# Altium project LCD_KB_CONTROLLER_hv2.PrjPcb
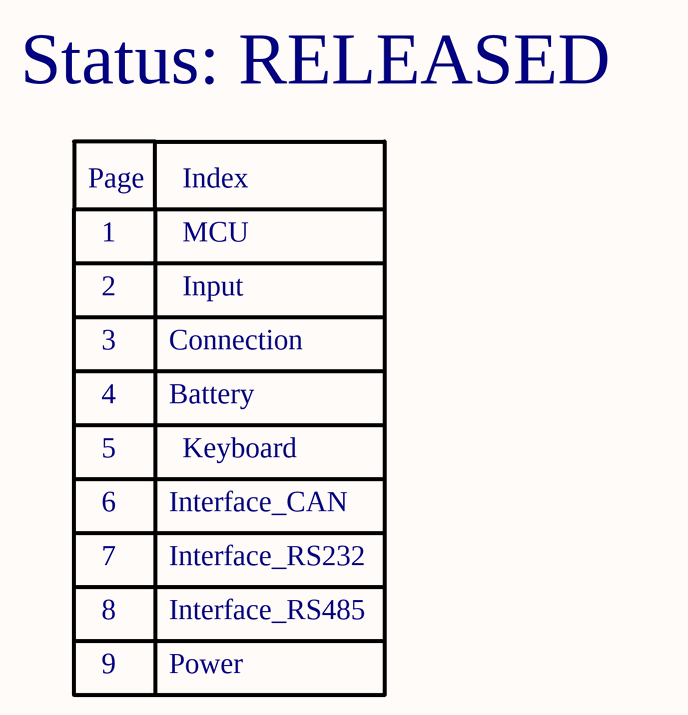
[diagram p0: [0]-Main_Page.SchDoc]
10 sheets, 136 parts. Net scope: flat (ports and power ports of the same name join across sheets).
Board file: LCD_KB_CONTROLLER_hv2.PcbDoc
Sheets:
  [0]-Main_Page.SchDoc
  [1]-MCU.SchDoc
  [2]-Input.SchDoc
  [3]-Connection.SchDoc
  [4]-Battery.SchDoc
  [5]-Keyboard.SchDoc
  [6]-Interface_CAN.SchDoc
  [7]-Interface_RS232.SchDoc
  [8]-Interface_RS485.SchDoc
  [9]-Power.SchDoc

## Sheet [0]-Main_Page.SchDoc
size A4

### Notes on the sheet
- Status: RELEASED
- Page
- Index
- 1
- MCU
- 2
- Input
- 3
- 4
- Connection
- Battery
- 5
- Keyboard
- 6
- Interface_CAN
- 7
- Interface_RS232
- 8
- 9
- Interface_RS485
- Power

## Sheet [1]-MCU.SchDoc
size A4
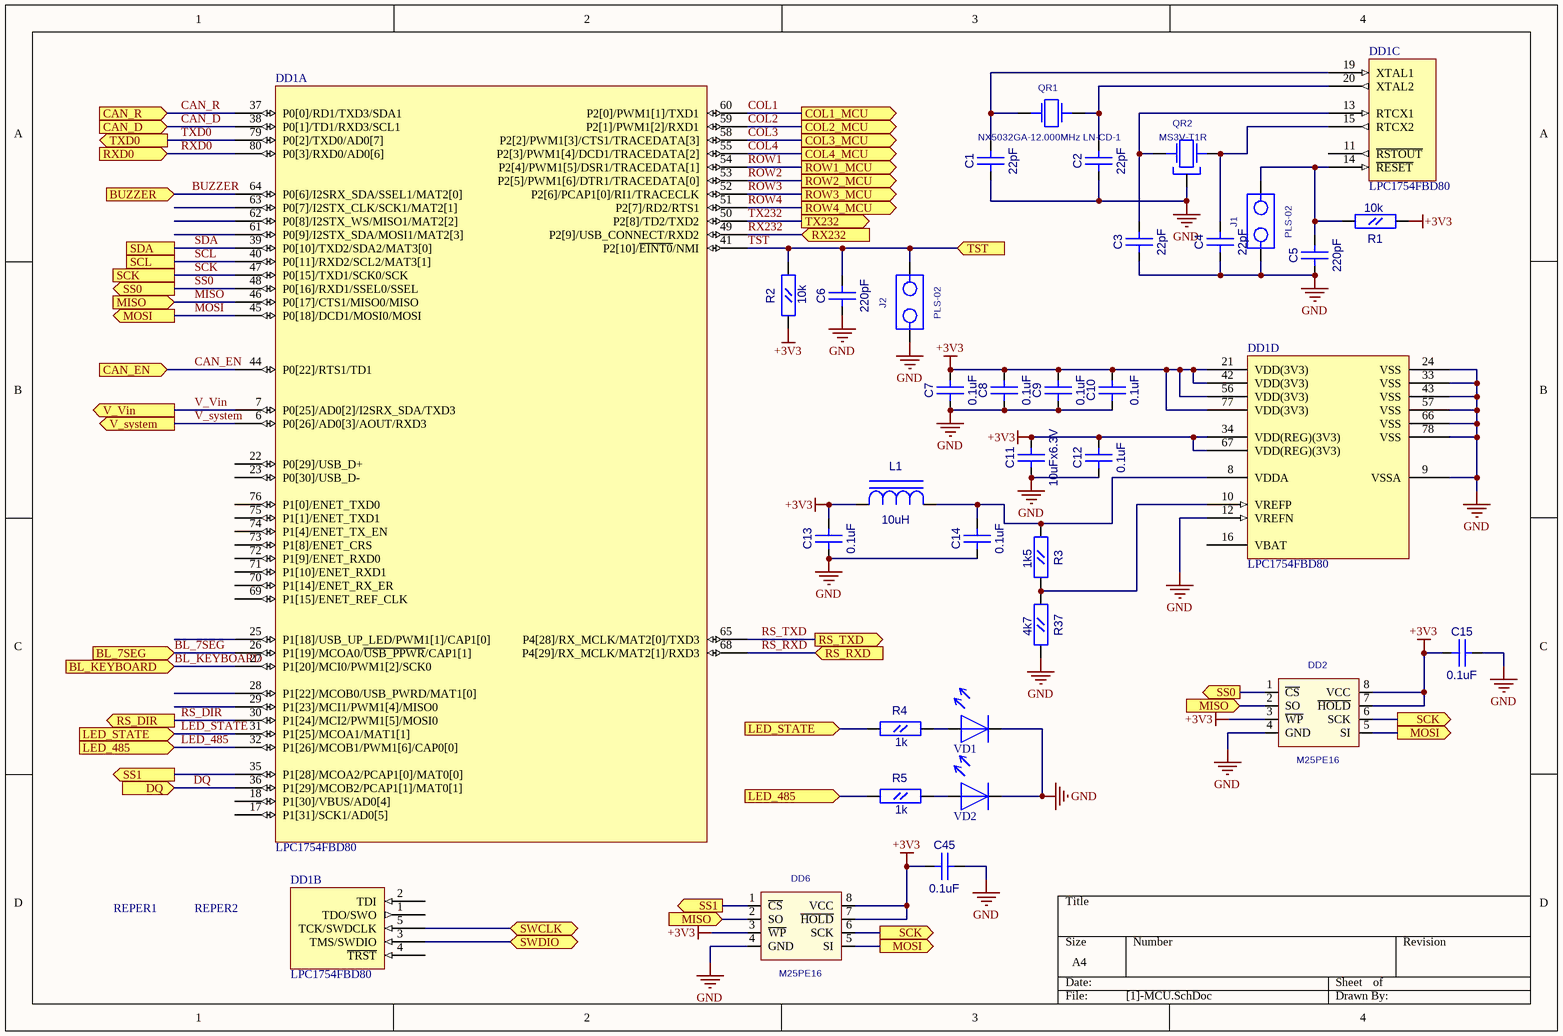
[diagram p1: [1]-MCU.SchDoc]

### Parts
C1  22pF  [CC0603]
C2  22pF  [CC0603]
C3  22pF  [CC0603]
C4  22pF  [CC0603]
C5  220pF  [CC0603]
C6  220pF  [CC0603]
C7  0.1uF  [CC0603]
C8  0.1uF  [CC0603]
C9  0.1uF  [CC0603]
C10  0.1uF  [CC0603]
C11  10uFx6.3V  [CC0805]
C12  0.1uF  [CC0603]
C13  0.1uF  [CC0603]
C14  0.1uF  [CC0603]
C15  0.1uF  [CC0603]
C45  0.1uF  [CC0603]
DD1  LPC1754FBD80  [TQFP-80_0.5]  (parts A,B,C,D of 4)
DD2  M25PE16  [EIAJ_SO8]
DD6  M25PE16  [EIAJ_SO8]
J1  PLS-02  [PLS-02]
J2  PLS-02  [PLS-02]
L1  10uH  [L0603]
QR1  NX5032GA-12.000MHz LN-CD-1  [AC5032_2]
QR2  MS3V-T1R  [MS3V-T1R]
R1  10k  [RC0603]
R2  10k  [RC0603]
R3  1k5  [RC0603]
R4  1k  [RC0603]
R5  1k  [RC0603]
R37  4k7  [RC0603]
REPER1  REPER1.2  [REPER1.2]  (value not drawn)
REPER2  REPER1.2  [REPER1.2]  (value not drawn)
VD1  LED_0805  [LED0805]  (value not drawn)
VD2  LED_0805  [LED0805]  (value not drawn)

### Ports
BL_7SEG (in), BL_KEYBOARD (in), BUZZER (in), CAN_D (in), CAN_EN (in), CAN_R (in), COL1_MCU (out), COL2_MCU (out), COL3_MCU (out), COL4_MCU (out), DQ (in), LED_485 (in), LED_STATE (in), MISO (in), MOSI (out), ROW1_MCU (out), ROW2_MCU (out), ROW3_MCU (out), ROW4_MCU (out), RS_DIR (out), RS_RXD (in), RS_TXD (out), RX232 (in), RXD0 (in), SCK, SCK (out), SCL, SDA, SS0 (out), SS1 (out), SWCLK (bidir), SWDIO (bidir), TST (in), TX232 (out), TXD0 (out), V_system (out), V_Vin (out)

### Nets
+3V3: C7.2(B) C8.2(B) C9.2(B) C10.2(B) C11.2(B) C12.2(B) C13.2(B) C15.1(A) C45.1(A) DD1.21(VDD(3V3)) DD1.34(VDD(REG)(3V3)) DD1.42(VDD(3V3)) DD1.56(VDD(3V3)) DD1.67(VDD(REG)(3V3)) DD1.77(VDD(3V3)) DD2.3(~{WP}) DD2.7(~{HOLD}) DD2.8(VCC) DD6.3(~{WP}) DD6.7(~{HOLD}) DD6.8(VCC) L1.1(A) R1.1(A) R2.1(A)
GND: C1.1(A) C2.1(A) C3.1(A) C4.1(A) C5.1(A) C6.1(A) C7.1(A) C8.1(A) C9.1(A) C10.1(A) C11.1(A) C12.1(A) C13.1(A) C14.1(A) C15.2(B) C45.2(B) DD1.9(VSSA) DD1.12(VREFN) DD1.24(VSS) DD1.33(VSS) DD1.43(VSS) DD1.57(VSS) DD1.66(VSS) DD1.78(VSS) DD2.4(GND) DD6.4(GND) J1.1 J2.1 QR2.3 R37.2(B) VD1.2 VD2.2
BL_7SEG: DD1.26(P1[19]/MCOA0/~{USB_PPWR}/CAP1[1]) ; port BL_7SEG
BL_KEYBOARD: DD1.27(P1[20]/MCI0/PWM1[2]/SCK0) ; port BL_KEYBOARD
BUZZER: DD1.64(P0[6]/I2SRX_SDA/SSEL1/MAT2[0]) ; port BUZZER
CAN_D: DD1.38(P0[1]/TD1/RXD3/SCL1) ; port CAN_D
CAN_EN: DD1.44(P0[22]/RTS1/TD1) ; port CAN_EN
CAN_R: DD1.37(P0[0]/RD1/TXD3/SDA1) ; port CAN_R
COL1: DD1.60(P2[0]/PWM1[1]/TXD1) ; port COL1_MCU
COL2: DD1.59(P2[1]/PWM1[2]/RXD1) ; port COL2_MCU
COL3: DD1.58(P2[2]/PWM1[3]/CTS1/TRACEDATA[3]) ; port COL3_MCU
COL4: DD1.55(P2[3]/PWM1[4]/DCD1/TRACEDATA[2]) ; port COL4_MCU
DQ: DD1.36(P1[29]/MCOB2/PCAP1[1]/MAT0[1]) ; port DQ
LED_485: DD1.32(P1[26]/MCOB1/PWM1[6]/CAP0[0]) R5.1(A) ; port LED_485
LED_STATE: DD1.31(P1[25]/MCOA1/MAT1[1]) R4.1(A) ; port LED_STATE
MISO: DD1.46(P0[17]/CTS1/MISO0/MISO) DD2.2(SO) DD6.2(SO) ; port MISO
MOSI: DD1.45(P0[18]/DCD1/MOSI0/MOSI) DD2.5(SI) DD6.5(SI) ; port MOSI
ROW1: DD1.54(P2[4]/PWM1[5]/DSR1/TRACEDATA[1]) ; port ROW1_MCU
ROW2: DD1.53(P2[5]/PWM1[6]/DTR1/TRACEDATA[0]) ; port ROW2_MCU
ROW3: DD1.52(P2[6]/PCAP1[0]/RI1/TRACECLK) ; port ROW3_MCU
ROW4: DD1.51(P2[7]/RD2/RTS1) ; port ROW4_MCU
RS_DIR: DD1.30(P1[24]/MCI2/PWM1[5]/MOSI0) ; port RS_DIR
RS_RXD: DD1.68(P4[29]/RX_MCLK/MAT2[1]/RXD3) ; port RS_RXD
RS_TXD: DD1.65(P4[28]/RX_MCLK/MAT2[0]/TXD3) ; port RS_TXD
RX232: DD1.49(P2[9]/USB_CONNECT/RXD2) ; port RX232
RXD0: DD1.80(P0[3]/RXD0/AD0[6]) ; port RXD0
SCK: DD1.47(P0[15]/TXD1/SCK0/SCK) DD2.6(SCK) DD6.6(SCK) ; port SCK
SCL: DD1.40(P0[11]/RXD2/SCL2/MAT3[1]) ; port SCL
SDA: DD1.39(P0[10]/TXD2/SDA2/MAT3[0]) ; port SDA
SS0: DD1.48(P0[16]/RXD1/SSEL0/SSEL) DD2.1(~{CS}) ; port SS0
TST: C6.2(B) DD1.41(P2[10]/~{EINT0}/NMI) J2.2 R2.2(B) ; port TST
TX232: DD1.50(P2[8]/TD2/TXD2) ; port TX232
TXD0: DD1.79(P0[2]/TXD0/AD0[7]) ; port TXD0
V_system: DD1.6(P0[26]/AD0[3]/AOUT/RXD3) ; port V_system
V_Vin: DD1.7(P0[25]/AD0[2]/I2SRX_SDA/TXD3) ; port V_Vin
NetC1_2: C1.2(B) DD1.19(XTAL1) QR1.1
NetC2_2: C2.2(B) DD1.20(XTAL2) QR1.2
NetC3_2: C3.2(B) DD1.13(RTCX1) QR2.2(X2)
NetC4_2: C4.2(B) DD1.15(RTCX2) QR2.1(X1)
NetC5_2: C5.2(B) DD1.14(~{RESET}) J1.2 R1.2(B)
NetC14_2: C14.2(B) DD1.8(VDDA) L1.2(C) R3.1(A)
NetDD1_3: DD1.3(TMS/SWDIO) ; port SWDIO
NetDD1_5: DD1.5(TCK/SWDCLK) ; port SWCLK
NetDD1_10: DD1.10(VREFP) R3.2(B) R37.1(A)
NetDD1_35: DD1.35(P1[28]/MCOA2/PCAP1[0]/MAT0[0]) DD6.1(~{CS}) ; port SS1
NetR4_2: R4.2(B) VD1.1
NetR5_2: R5.2(B) VD2.1

Not connected (* = marked no-connect by the designer): DD1 1(TDO/SWO) 2(TDI) 4(~{TRST}) 11(~{RSTOUT}) 16(VBAT) 17(P1[31]/SCK1/AD0[5]) 18(P1[30]/VBUS/AD0[4]) 22(P0[29]/USB_D+) 23(P0[30]/USB_D-) 25(P1[18]/USB_UP_LED/PWM1[1]/CAP1[0]) 28(P1[22]/MCOB0/USB_PWRD/MAT1[0]) 29(P1[23]/MCI1/PWM1[4]/MISO0) 61(P0[9]/I2STX_SDA/MOSI1/MAT2[3]) 62(P0[8]/I2STX_WS/MISO1/MAT2[2]) 63(P0[7]/I2STX_CLK/SCK1/MAT2[1]) 69(P1[15]/ENET_REF_CLK) 70(P1[14]/ENET_RX_ER) 71(P1[10]/ENET_RXD1) 72(P1[9]/ENET_RXD0) 73(P1[8]/ENET_CRS) 74(P1[4]/ENET_TX_EN) 75(P1[1]/ENET_TXD1) 76(P1[0]/ENET_TXD0); REPER1 1; REPER2 1

### Library data of the parts
C1-C10 C12-C15 C45 = CC0603
  C1-C4: Value: 22pF
  C5 C6: Value: 220pF
  C7-C10 C12-C15 C45: Value: 0.1uF
C11 = CC0805: Value: 10uFx6.3V
DD1 = LPC1754FBD80: Cortex -M3 32-Bit Microcontroller, 128KB Flash, 64KB RAM, 800-Lead LQFP; ComponentLink1Description: Manufacturer Link; ComponentLink1URL: http://www.nxp.com/
DD2 DD6 = S25FL016A0LMFI01: Value: M25PE16
L1 = L0603: Value: 10uH
QR1 = AC5032_2: AC5032/2; Value: NX5032GA-12.000MHz LN-CD-1
QR2 = MS3V-T1R: CRYSTAL_32768 Hz; Value: *
R1-R5 R37 = RC0603
  R1 R2: Value: 10k
  R3: Value: 1k5
  R4 R5: Value: 1k
  R37: Value: 4k7
J1 J2 = PLS-02: Value: *
REPER1 REPER2 = REPER1.2: Value: *
VD1 VD2 = LED_0805: Value: LED_0805

## Sheet [2]-Input.SchDoc
size A4
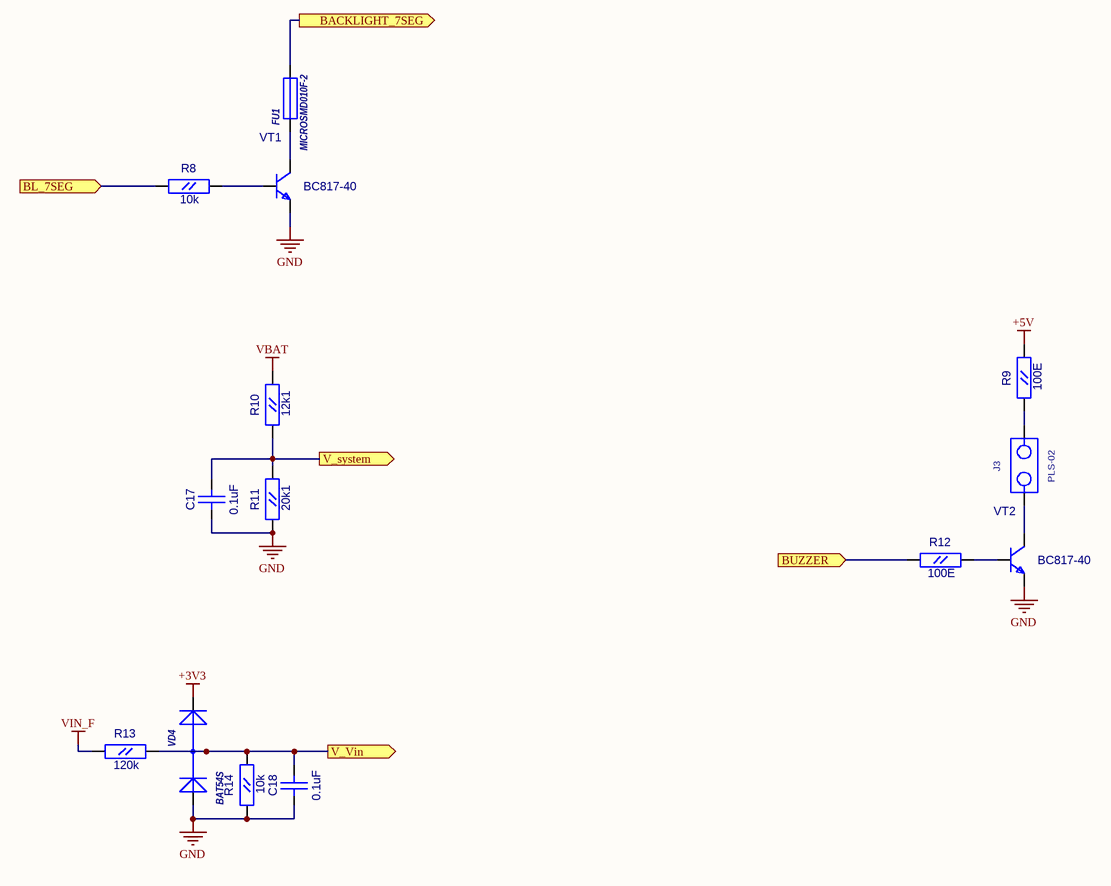
[diagram p2: [2]-Input.SchDoc]

### Parts
C17  0.1uF  [CC0603]
C18  0.1uF  [CC0603]
FU1  MICROSMD010F-2  [RC1210]
J3  PLS-02  [PLS-02]
R8  10k  [RC0603]
R9  100E  [RC0603]
R10  12k1  [RC0603]
R11  20k1  [RC0603]
R12  100E  [RC0603]
R13  120k  [RC0603]
R14  10k  [RC0603]
VD4  BAT54S  [SOT-23(GSD)]
VT1  BC817-40  [SOT-23(123)]
VT2  BC817-40  [SOT-23(123)]

### Ports
BACKLIGHT_7SEG (out), BL_7SEG (in), BUZZER (in), V_system (out), V_Vin (out)

### Nets
+3V3: VD4.2(K)
+5V: R9.2(B)
GND: C17.1(A) C18.1(A) R11.1(A) R14.1(A) VD4.1(A) VT1.2(E) VT2.2(E)
VBAT: R10.2(B)
VIN_F: R13.1(A)
BL: FU1.2 ; port BACKLIGHT_7SEG
BL_7SEG: R8.1(A) ; port BL_7SEG
BUZZER: R12.1(A) ; port BUZZER
V_system: C17.2(B) R10.1(A) R11.2(B) ; port V_system
V_Vin: C18.2(B) R13.2(B) R14.2(B) VD4.3(AK) ; port V_Vin
NetFU1_1: FU1.1 VT1.3(C)
NetJ3_1: J3.1 VT2.3(C)
NetJ3_2: J3.2 R9.1(A)
NetR8_2: R8.2(B) VT1.1(B)
NetR12_2: R12.2(B) VT2.1(B)

### Library data of the parts
C17 C18 = CC0603: Value: 0.1uF
FU1 = MICROSMD: Value: MICROSMD010F-2
R8-R14 = RC0603
  R8 R14: Value: 10k
  R9 R12: Value: 100E
  R10: Value: 12k1
  R11: Value: 20k1
  R13: Value: 120k
VD4 = BAT54S: 1.0 Ampere General Purpose Rectifier; ComponentField6: Published 8-Jun-2000, Modified 11-July-2000: SIM Model Added.; Value: *
VT1 VT2 = BC846BLT1: NPN 500ma transistor; ComponentField7: Published 29-Sep-2000; OriginalName: BC846BLT1; Value: BC817-40
J3 = PLS-02: Value: *

## Sheet [3]-Connection.SchDoc
size A4
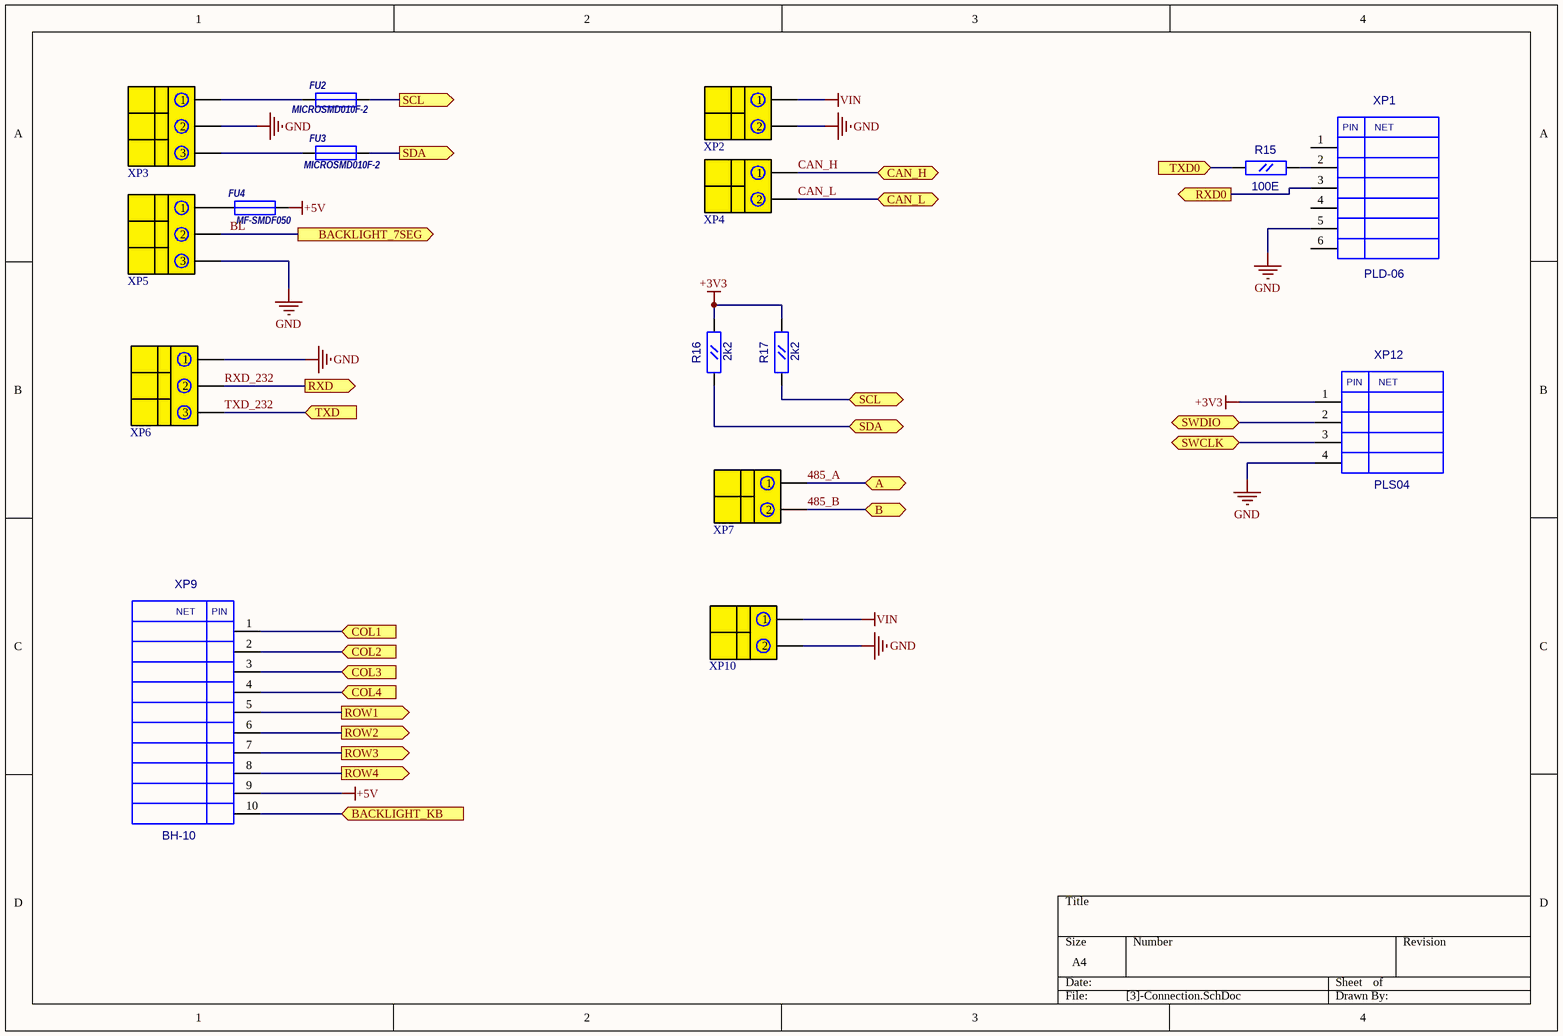
[diagram p3: [3]-Connection.SchDoc]

### Parts
FU2  MICROSMD010F-2  [RC1210]
FU3  MICROSMD010F-2  [RC1210]
FU4  MF-SMDF050  [MF-SMDF]
R15  100E  [RC0603]
R16  2k2  [RC0603]
R17  2k2  [RC0603]
XP1  PLD-06  [PIN6]
XP2  DG330-2PIN  [DG330-2PIN]  (value not drawn)
XP3  DG330-3PIN  [DG330-3PIN]  (value not drawn)
XP4  DG330-2PIN  [DG330-2PIN]  (value not drawn)
XP5  DG330-3PIN  [DG330-3PIN]  (value not drawn)
XP6  DG330-3P  [DG330-3PIN]  (value not drawn)
XP7  DG330-2PIN  [DG330-2PIN]  (value not drawn)
XP9  BH-10  [BH-10]
XP10  DG330-2PIN  [DG330-2PIN]  (value not drawn)
XP12  PLS04  [PIN04S]

### Ports
A (bidir), B (bidir), BACKLIGHT_7SEG (out), BACKLIGHT_KB (in), CAN_H (bidir), CAN_L (bidir), COL1 (in), COL2 (in), COL3 (in), COL4 (in), ROW1 (out), ROW2 (out), ROW3 (out), ROW4 (out), RXD0 (out), RXD (out), SCL (bidir), SCL (out), SDA (bidir), SDA (out), SWCLK (bidir), SWDIO (bidir), TXD0 (in), TXD (in)

### Nets
+3V3: R16.2(B) R17.2(B) XP12.1
+5V: FU4.2 XP9.9
GND: XP1.5 XP2.2 XP3.2 XP5.3 XP6.1 XP10.2 XP12.4
VIN: XP2.1 XP10.1
485_A: XP7.1 ; port A
485_B: XP7.2 ; port B
BL: XP5.2 ; port BACKLIGHT_7SEG
CAN_H: XP4.1 ; port CAN_H
CAN_L: XP4.2 ; port CAN_L
ROW1: XP9.5 ; port ROW1
ROW2: XP9.6 ; port ROW2
ROW3: XP9.7 ; port ROW3
ROW4: XP9.8 ; port ROW4
RXD0: XP1.3 ; port RXD0
RXD_232: XP6.2 ; port RXD  [project net RXD]
SCL: FU2.2 R17.1(A) ; port SCL
SDA: FU3.2 R16.1(A) ; port SDA
TXD0: R15.1(A) ; port TXD0
TXD_232: XP6.3 ; port TXD
NetDD1_3: XP12.2 ; port SWDIO
NetDD1_5: XP12.3 ; port SWCLK
NetFU2_1: FU2.1 XP3.1
NetFU3_1: FU3.1 XP3.3
NetFU4_1: FU4.1 XP5.1
NetFU5_2: XP9.10 ; port BACKLIGHT_KB
NetR15_2: R15.2(B) XP1.2
NetVD5_1: XP9.3 ; port COL3
NetVD6_1: XP9.1 ; port COL1
NetVD7_1: XP9.4 ; port COL4
NetVD8_1: XP9.2 ; port COL2

Not connected (* = marked no-connect by the designer): XP1 1 4 6

### Notes on the sheet
- (in symbol BH-10) NET; PIN
- (in symbol PLD-06) PIN; NET
- (in symbol PLS04) PIN; NET

### Library data of the parts
FU2 FU3 = MICROSMD: Value: MICROSMD010F-2
FU4 = MF-SMDF: Value: MF-SMDF050
R15-R17 = RC0603
  R15: Value: 100E
  R16 R17: Value: 2k2
XP1 = PLD-06: PLD06; Value: *
XP6 = DG330-3PIN: Value: DG330-3P
XP2 XP4 XP7 XP10 = DG330-2PIN: Value: DG330-2PIN
XP3 XP5 = DG330-3PIN: Value: DG330-3PIN
XP9 = BH-10: Value: *
XP12 = PLS04: Value: *

## Sheet [4]-Battery.SchDoc
size A4
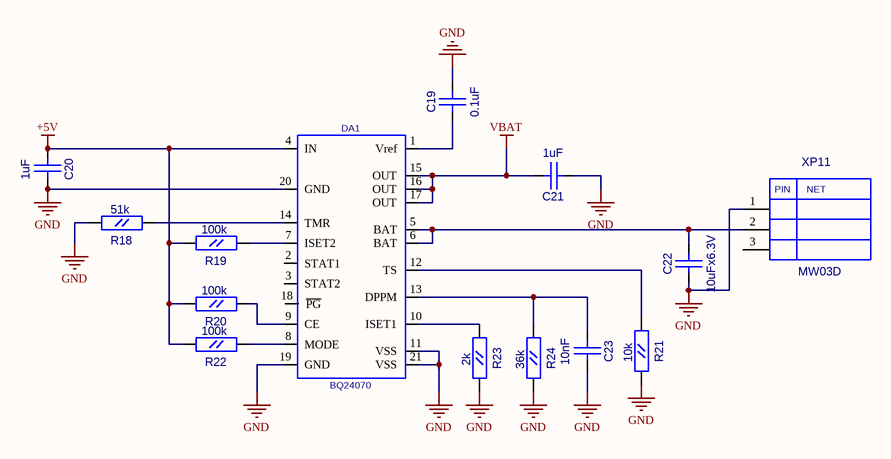
[diagram p4: [4]-Battery.SchDoc]

### Parts
C19  0.1uF  [CC0603]
C20  1uF  [CC0603]
C21  1uF  [CC0603]
C22  10uFx6.3V  [CC0805]
C23  10nF  [CC0603]
DA1  BQ24070  [P-PQFP-N20]
R18  51k  [RC0603]
R19  100k  [RC0603]
R20  100k  [RC0603]
R21  10k  [RC0603]
R22  100k  [RC0603]
R23  2k  [RC0603]
R24  36k  [RC0603]
XP11  MW03D  [MW03D]

### Nets
+5V: C20.1(A) DA1.4(IN) R19.2(B) R20.2(B) R22.2(B)
GND: C19.2(B) C20.2(B) C21.1(A) C22.1(A) C23.2(B) DA1.11(VSS) DA1.19(GND) DA1.20(GND) DA1.21(VSS) R18.2(B) R21.2(B) R23.2(B) R24.2(B) XP11.1
VBAT: C21.2(B) DA1.15(OUT) DA1.16(OUT) DA1.17(OUT)
NetC19_1: C19.1(A) DA1.1(Vref)
NetC22_2: C22.2(B) DA1.5(BAT) DA1.6(BAT) XP11.2
NetC23_1: C23.1(A) DA1.13(DPPM) R24.1(A)
NetDA1_7: DA1.7(ISET2) R19.1(A)
NetDA1_8: DA1.8(MODE) R22.1(A)
NetDA1_9: DA1.9(CE) R20.1(A)
NetDA1_10: DA1.10(ISET1) R23.1(A)
NetDA1_12: DA1.12(TS) R21.1(A)
NetDA1_14: DA1.14(TMR) R18.1(A)

Not connected (* = marked no-connect by the designer): DA1 2(STAT1) 3(STAT2) 18(~{PG}); XP11 3

### Notes on the sheet
- (in symbol MW03D) PIN; NET

### Library data of the parts
C19-C21 C23 = CC0603
  C19: Value: 0.1uF
  C20 C21: Value: 1uF
  C23: Value: 10nF
C22 = CC0805: Value: 10uFx6.3V
R18-R24 = RC0603
  R18: Value: 51k
  R19 R20 R22: Value: 100k
  R21: Value: 10k
  R23: Value: 2k
  R24: Value: 36k
DA1 = BQ24070: Value: *
XP11 = MW03D: Value: *

## Sheet [5]-Keyboard.SchDoc
size A4
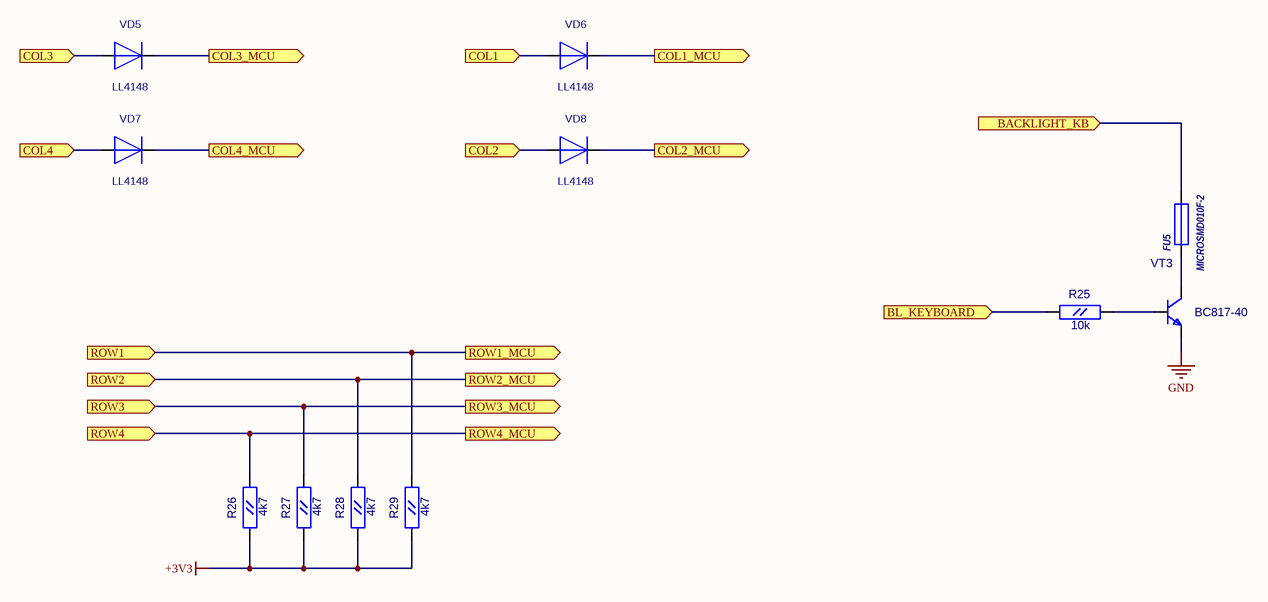
[diagram p5: [5]-Keyboard.SchDoc]

### Parts
FU5  MICROSMD010F-2  [RC1210]
R25  10k  [RC0603]
R26  4k7  [RC0603]
R27  4k7  [RC0603]
R28  4k7  [RC0603]
R29  4k7  [RC0603]
VD5  LL4148  [SOD-80]
VD6  LL4148  [SOD-80]
VD7  LL4148  [SOD-80]
VD8  LL4148  [SOD-80]
VT3  BC817-40  [SOT-23(123)]

### Ports
BACKLIGHT_KB (in), BL_KEYBOARD (in), COL1 (in), COL1_MCU (out), COL2 (in), COL2_MCU (out), COL3 (in), COL3_MCU (out), COL4 (in), COL4_MCU (out), ROW1 (in), ROW1_MCU (out), ROW2 (in), ROW2_MCU (out), ROW3 (in), ROW3_MCU (out), ROW4 (in), ROW4_MCU (out)

### Nets
+3V3: R26.1(A) R27.1(A) R28.1(A) R29.1(A)
GND: VT3.2(E)
BL_KEYBOARD: R25.1(A) ; port BL_KEYBOARD
COL1: VD6.2(+) ; port COL1_MCU
COL2: VD8.2(+) ; port COL2_MCU
COL3: VD5.2(+) ; port COL3_MCU
COL4: VD7.2(+) ; port COL4_MCU
ROW1: R29.2(B) ; port ROW1_MCU, port ROW1
ROW2: R28.2(B) ; port ROW2_MCU, port ROW2
ROW3: R27.2(B) ; port ROW3_MCU, port ROW3
ROW4: R26.2(B) ; port ROW4_MCU, port ROW4
NetFU5_1: FU5.1 VT3.3(C)
NetFU5_2: FU5.2 ; port BACKLIGHT_KB
NetR25_2: R25.2(B) VT3.1(B)
NetVD5_1: VD5.1(-) ; port COL3
NetVD6_1: VD6.1(-) ; port COL1
NetVD7_1: VD7.1(-) ; port COL4
NetVD8_1: VD8.1(-) ; port COL2

### Library data of the parts
FU5 = MICROSMD: Value: MICROSMD010F-2
R25-R29 = RC0603
  R25: Value: 10k
  R26-R29: Value: 4k7
VT3 = BC846BLT1: as VT1 on sheet [2]-Input; OriginalName: BC846BLT1; Value: BC817-40
VD5-VD8 = LL4148: Value: *

## Sheet [6]-Interface_CAN.SchDoc
size A4
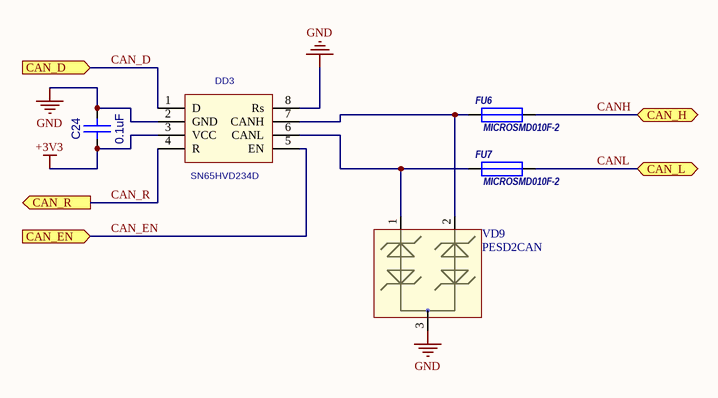
[diagram p6: [6]-Interface_CAN.SchDoc]

### Parts
C24  0.1uF  [CC0603]
DD3  SN65HVD234D  [SO-8]
FU6  MICROSMD010F-2  [RC1210]
FU7  MICROSMD010F-2  [RC1210]
VD9  PESD2CAN  [SOT-23(123)]

### Ports
CAN_D (in), CAN_EN (in), CAN_H (bidir), CAN_L (bidir), CAN_R (out)

### Nets
+3V3: C24.1(A) DD3.3(VCC)
GND: C24.2(B) DD3.2(GND) DD3.8(Rs) VD9.3
CAN_D: DD3.1(D) ; port CAN_D
CAN_EN: DD3.5(EN) ; port CAN_EN
CAN_R: DD3.4(R) ; port CAN_R
CANH: FU6.2 ; port CAN_H  [project net CAN_H]
CANL: FU7.2 ; port CAN_L  [project net CAN_L]
NetDD3_6: DD3.6(CANL) FU7.1 VD9.1
NetDD3_7: DD3.7(CANH) FU6.1 VD9.2

### Library data of the parts
C24 = CC0603: Value: 0.1uF
DD3 = SN65HVD234D: CAN Transceiver; Value: *
FU6 FU7 = MICROSMD: Value: MICROSMD010F-2
VD9 = PESD2CAN: TVS for CAN

## Sheet [7]-Interface_RS232.SchDoc
size A4
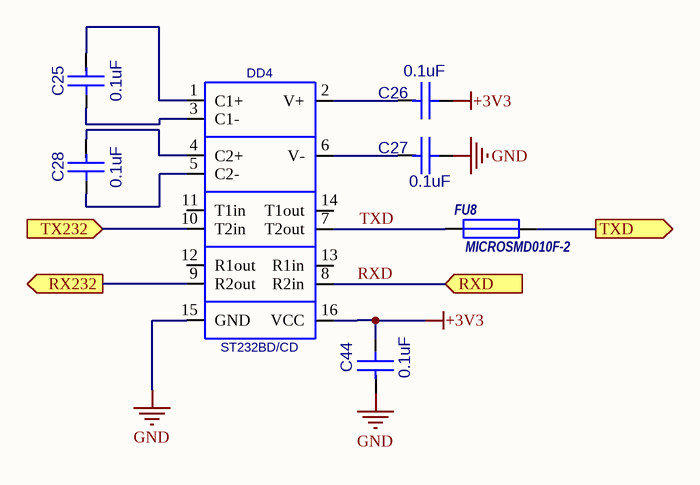
[diagram p7: [7]-Interface_RS232.SchDoc]

### Parts
C25  0.1uF  [CC0603]
C26  0.1uF  [CC0603]
C27  0.1uF  [CC0603]
C28  0.1uF  [CC0603]
C44  0.1uF  [CC0603]
DD4  ST232BD/CD  [SO16_M]
FU8  MICROSMD010F-2  [RC1210]

### Ports
RX232 (out), RXD (in), TX232 (in), TXD (out)

### Nets
+3V3: C26.1(A) C44.1(A) DD4.16(VCC)
GND: C27.1(A) C44.2(B) DD4.15(GND)
RX232: DD4.9(R2out) ; port RX232
RXD: DD4.8(R2in) ; port RXD
TX232: DD4.10(T2in) ; port TX232
TXD: DD4.7(T2out) FU8.1
TXD_232: FU8.2 ; port TXD
NetC25_1: C25.1(A) DD4.3(C1-)
NetC25_2: C25.2(B) DD4.1(C1+)
NetC26_2: C26.2(B) DD4.2(V+)
NetC27_2: C27.2(B) DD4.6(V-)
NetC28_1: C28.1(A) DD4.5(C2-)
NetC28_2: C28.2(B) DD4.4(C2+)

Not connected (* = marked no-connect by the designer): DD4 11(T1in) 12(R1out) 13(R1in) 14(T1out)

### Library data of the parts
C25-C28 C44 = CC0603: Value: 0.1uF
FU8 = MICROSMD: Value: MICROSMD010F-2
DD4 = ST232BD/CD: Value: *

## Sheet [8]-Interface_RS485.SchDoc
size A4
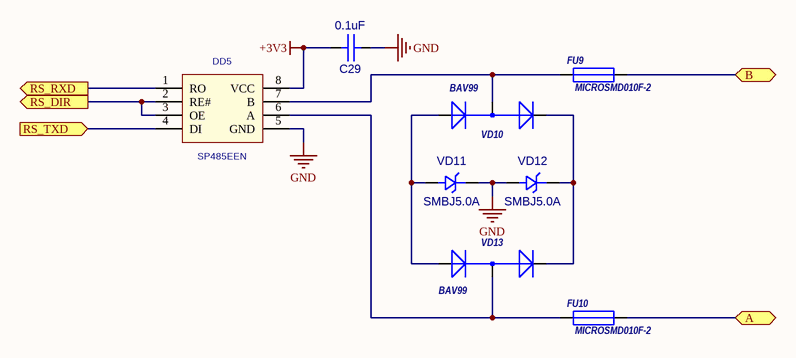
[diagram p8: [8]-Interface_RS485.SchDoc]

### Parts
C29  0.1uF  [CC0603]
DD5  SP485EEN  [SO-8]
FU9  MICROSMD010F-2  [RC1210]
FU10  MICROSMD010F-2  [RC1210]
VD10  BAV99  [SOT-23(GSD)]
VD11  SMBJ5.0A  [SMB]
VD12  SMBJ5.0A  [SMB]
VD13  BAV99  [SOT-23(GSD)]

### Ports
A (bidir), B (bidir), RS_DIR (out), RS_RXD (out), RS_TXD (in)

### Nets
+3V3: C29.2(B) DD5.8(VCC)
GND: C29.1(A) DD5.5(GND) VD11.2(K) VD12.1(A)
485_A: FU10.2 ; port A
485_B: FU9.2 ; port B
RS_DIR: DD5.2(RE#) DD5.3(OE) ; port RS_DIR
RS_RXD: DD5.1(RO) ; port RS_RXD
RS_TXD: DD5.4(DI) ; port RS_TXD
NetDD5_6: DD5.6(A) FU10.1 VD13.3(AK)
NetDD5_7: DD5.7(B) FU9.1 VD10.3(AK)
NetVD10_1: VD10.1(A) VD11.1(A) VD13.1(A)
NetVD10_2: VD10.2(K) VD12.2(K) VD13.2(K)

### Library data of the parts
C29 = CC0603: Value: 0.1uF
DD5 = SP485: Value: *
FU9 FU10 = MICROSMD: Value: MICROSMD010F-2
VD10 VD13 = BAV99: 1.0 Ampere General Purpose Rectifier; ComponentField6: Published 8-Jun-2000, Modified 11-July-2000: SIM Model Added.; Value: *
VD11 VD12 = SMBJ: Value: SMBJ5.0A

## Sheet [9]-Power.SchDoc
size A4
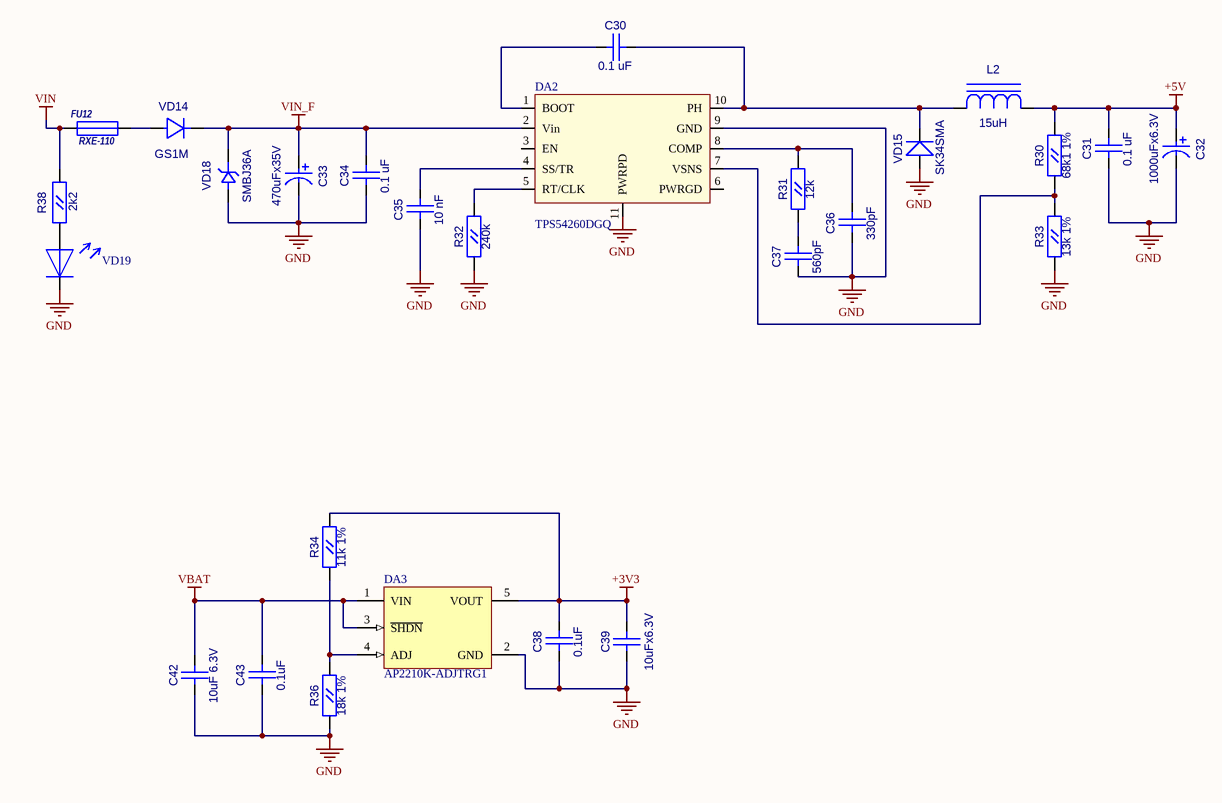
[diagram p9: [9]-Power.SchDoc]

### Parts
C30  0.1 uF  [CC0603]
C31  0.1 uF  [CC0603]
C32  1000uFx6.3V  [CC8X3.5]
C33  470uFx35V  [CC16X10_CAP0.5(1)(Primary)]
C34  0.1 uF  [CC0603]
C35  10 nF  [CC0603]
C36  330pF  [CC0603]
C37  560pF  [CC0603]
C38  0.1uF  [CC0603]
C39  10uFx6.3V  [CC0805]
C42  10uF 6.3V  [CC0805]
C43  0.1uF  [CC0603]
DA2  TPS54260DGQ  [S-PDSO-G10]
DA3  AP2210K-ADJTRG1  [SOT23-5]
FU12  RXE-110  [RXE-110]
L2  15uH  [SDR0805]
R30  68k1 1%  [RC0603]
R31  12k  [RC0603]
R32  240k  [RC0603]
R33  13k 1%  [RC0603]
R34  11k 1%  [RC0603]
R36  18k 1%  [RC0603]
R38  2k2  [RC0603]
VD14  GS1M  [SMA]
VD15  SK34SMA  [SMA]
VD18  SMBJ36A  [SMB]
VD19  LED_0805  [LED0805]  (value not drawn)

### Nets
+3V3: C38.1(A) C39.2(B) DA3.5(VOUT) R34.2(B)
+5V: C31.1(A) C32.1 L2.2(A) R30.2(B)
GND: C31.2(B) C32.2 C33.1 C34.2(B) C35.2(B) C36.2(B) C37.2(B) C38.2(B) C39.1(A) C42.1(A) C43.2(B) DA2.9(GND) DA2.11(PWRPD) DA3.2(GND) R32.1(A) R33.1(A) R36.1(A) VD15.1(A) VD18.1(A) VD19.2
VBAT: C42.2(B) C43.1(A) DA3.1(VIN) DA3.3(~{SHDN})
VIN: FU12.1 R38.2(B)
VIN_F: C33.2 C34.1(A) DA2.2(Vin) VD14.2(K) VD18.2(K)
NetC30_1: C30.1(A) DA2.10(PH) L2.1(C) VD15.2(K)
NetC30_2: C30.2(B) DA2.1(BOOT)
NetC35_1: C35.1(A) DA2.4(SS/TR)
NetC36_1: C36.1(A) DA2.8(COMP) R31.2(B)
NetC37_1: C37.1(A) R31.1(A)
NetDA2_5: DA2.5(RT/CLK) R32.2(B)
NetDA2_7: DA2.7(VSNS) R30.1(A) R33.2(B)
NetDA3_4: DA3.4(ADJ) R34.1(A) R36.2(B)
NetFU12_2: FU12.2 VD14.1(A)
NetR38_1: R38.1(A) VD19.1

Not connected (* = marked no-connect by the designer): DA2 3(EN) 6(PWRGD)

### Library data of the parts
C30 C31 C34-C38 C43 = CC0603
  C30 C31 C34: Value: 0.1 uF
  C35: Value: 10 nF
  C36: Value: 330pF
  C37: Value: 560pF
  C38 C43: Value: 0.1uF
C32 = CAP0.35: Value: 1000uFx6.3V
C33 = CAP0.5(1): Value: 470uFx35V
C39 C42 = CC0805
  C39: Value: 10uFx6.3V
  C42: Value: 10uF 6.3V
DA3 = MCP1824T-ADJE/OT: 300 mA, Low Voltage, Low Quiescent Current LDO Regulator, 5-Pin SOT-223, Extended Temperature, Tape and Reel; Published: 29-Jan-2009; DatasheetVersion: revA, Aug-2007; PackageVersion: revAW, Oct-2008; PackageReference: SOT-223-DC5; Publisher: Altium Limited; PackageDescription: 5-Lead Plastic Small Outline Transistor (DC) [SOT-223]; ComponentLink1Description: Manufacturer Link; ComponentLink1URL: http://www.microchip.com; ComponentLink2Description: Datasheet; ComponentLink2URL: http://ww1.microchip.com/downloads/en/DeviceDoc/22070a.pdf; ComponentLink3Description: Packaging Specification; ComponentLink3URL: http://ww1.microchip.com/downloads/en/PackagingSpec/00049AW.pdf
L2 = SDR0805: Value: 15uH
R30-R34 R36 R38 = RC0603
  R30: Value: 68k1 1%
  R31: Value: 12k
  R32: Value: 240k
  R33: Value: 13k 1%
  R34: Value: 11k 1%
  R36: Value: 18k 1%
  R38: Value: 2k2
VD14 = GS1M: Value: {Value}
VD15 = SK34SMA: Schottky Rectifier; Value: {Value}
VD18 = SMBJ: Value: SMBJ36A
FU12 = RXE-110: Value: *
VD19 = LED_0805: Value: LED_0805

## Nets that join several sheets
+3V3: [1]-MCU (24 pins), [2]-Input (VD4.2), [3]-Connection (R16.2 R17.2 XP12.1), [5]-Keyboard (R26.1 R27.1 R28.1 R29.1), [6]-Interface_CAN (C24.1 DD3.3), [7]-Interface_RS232 (C26.1 C44.1 DD4.16), [8]-Interface_RS485 (C29.2 DD5.8), [9]-Power (C38.1 C39.2 DA3.5 R34.2)
+5V: [2]-Input (R9.2), [3]-Connection (FU4.2 XP9.9), [4]-Battery (5 pins), [9]-Power (C31.1 C32.1 L2.2 R30.2)
GND: [1]-MCU (32 pins), [2]-Input (7 pins), [3]-Connection (7 pins), [4]-Battery (14 pins), [5]-Keyboard (VT3.2), [6]-Interface_CAN (C24.2 DD3.2 DD3.8 VD9.3), [7]-Interface_RS232 (C27.1 C44.2 DD4.15), [8]-Interface_RS485 (C29.1 DD5.5 VD11.2 VD12.1), [9]-Power (20 pins)
VBAT: [2]-Input (R10.2), [4]-Battery (C21.2 DA1.15 DA1.16 DA1.17), [9]-Power (C42.2 C43.1 DA3.1 DA3.3)
VIN: [3]-Connection (XP2.1 XP10.1), [9]-Power (FU12.1 R38.2)
VIN_F: [2]-Input (R13.1), [9]-Power (5 pins)
485_A: [3]-Connection (XP7.1), [8]-Interface_RS485 (FU10.2)
485_B: [3]-Connection (XP7.2), [8]-Interface_RS485 (FU9.2)
BL: [2]-Input (FU1.2), [3]-Connection (XP5.2)
BL_7SEG: [1]-MCU (DD1.26), [2]-Input (R8.1)
BL_KEYBOARD: [1]-MCU (DD1.27), [5]-Keyboard (R25.1)
BUZZER: [1]-MCU (DD1.64), [2]-Input (R12.1)
CAN_D: [1]-MCU (DD1.38), [6]-Interface_CAN (DD3.1)
CAN_EN: [1]-MCU (DD1.44), [6]-Interface_CAN (DD3.5)
CAN_H: [3]-Connection (XP4.1), [6]-Interface_CAN (FU6.2)
CAN_L: [3]-Connection (XP4.2), [6]-Interface_CAN (FU7.2)
CAN_R: [1]-MCU (DD1.37), [6]-Interface_CAN (DD3.4)
COL1: [1]-MCU (DD1.60), [5]-Keyboard (VD6.2)
COL2: [1]-MCU (DD1.59), [5]-Keyboard (VD8.2)
COL3: [1]-MCU (DD1.58), [5]-Keyboard (VD5.2)
COL4: [1]-MCU (DD1.55), [5]-Keyboard (VD7.2)
NetDD1_3: [1]-MCU (DD1.3), [3]-Connection (XP12.2)
NetDD1_5: [1]-MCU (DD1.5), [3]-Connection (XP12.3)
NetFU5_2: [3]-Connection (XP9.10), [5]-Keyboard (FU5.2)
NetVD5_1: [3]-Connection (XP9.3), [5]-Keyboard (VD5.1)
NetVD6_1: [3]-Connection (XP9.1), [5]-Keyboard (VD6.1)
NetVD7_1: [3]-Connection (XP9.4), [5]-Keyboard (VD7.1)
NetVD8_1: [3]-Connection (XP9.2), [5]-Keyboard (VD8.1)
ROW1: [1]-MCU (DD1.54), [3]-Connection (XP9.5), [5]-Keyboard (R29.2)
ROW2: [1]-MCU (DD1.53), [3]-Connection (XP9.6), [5]-Keyboard (R28.2)
ROW3: [1]-MCU (DD1.52), [3]-Connection (XP9.7), [5]-Keyboard (R27.2)
ROW4: [1]-MCU (DD1.51), [3]-Connection (XP9.8), [5]-Keyboard (R26.2)
RS_DIR: [1]-MCU (DD1.30), [8]-Interface_RS485 (DD5.2 DD5.3)
RS_RXD: [1]-MCU (DD1.68), [8]-Interface_RS485 (DD5.1)
RS_TXD: [1]-MCU (DD1.65), [8]-Interface_RS485 (DD5.4)
RX232: [1]-MCU (DD1.49), [7]-Interface_RS232 (DD4.9)
RXD: [3]-Connection (XP6.2), [7]-Interface_RS232 (DD4.8)
RXD0: [1]-MCU (DD1.80), [3]-Connection (XP1.3)
SCL: [1]-MCU (DD1.40), [3]-Connection (FU2.2 R17.1)
SDA: [1]-MCU (DD1.39), [3]-Connection (FU3.2 R16.1)
TX232: [1]-MCU (DD1.50), [7]-Interface_RS232 (DD4.10)
TXD0: [1]-MCU (DD1.79), [3]-Connection (R15.1)
TXD_232: [3]-Connection (XP6.3), [7]-Interface_RS232 (FU8.2)
V_system: [1]-MCU (DD1.6), [2]-Input (C17.2 R10.1 R11.2)
V_Vin: [1]-MCU (DD1.7), [2]-Input (C18.2 R13.2 R14.2 VD4.3)